# Altium schematic sheet MGT.SchDoc: FPGA MGTs
size B; Organization: UCLA High Energy Physics; DocumentNumber: 6; Revision: 2.0; SheetNumber: 6; SheetTotal: 12; CurrentDate: 8/7/2018; ModifiedDate: 8/20/2018
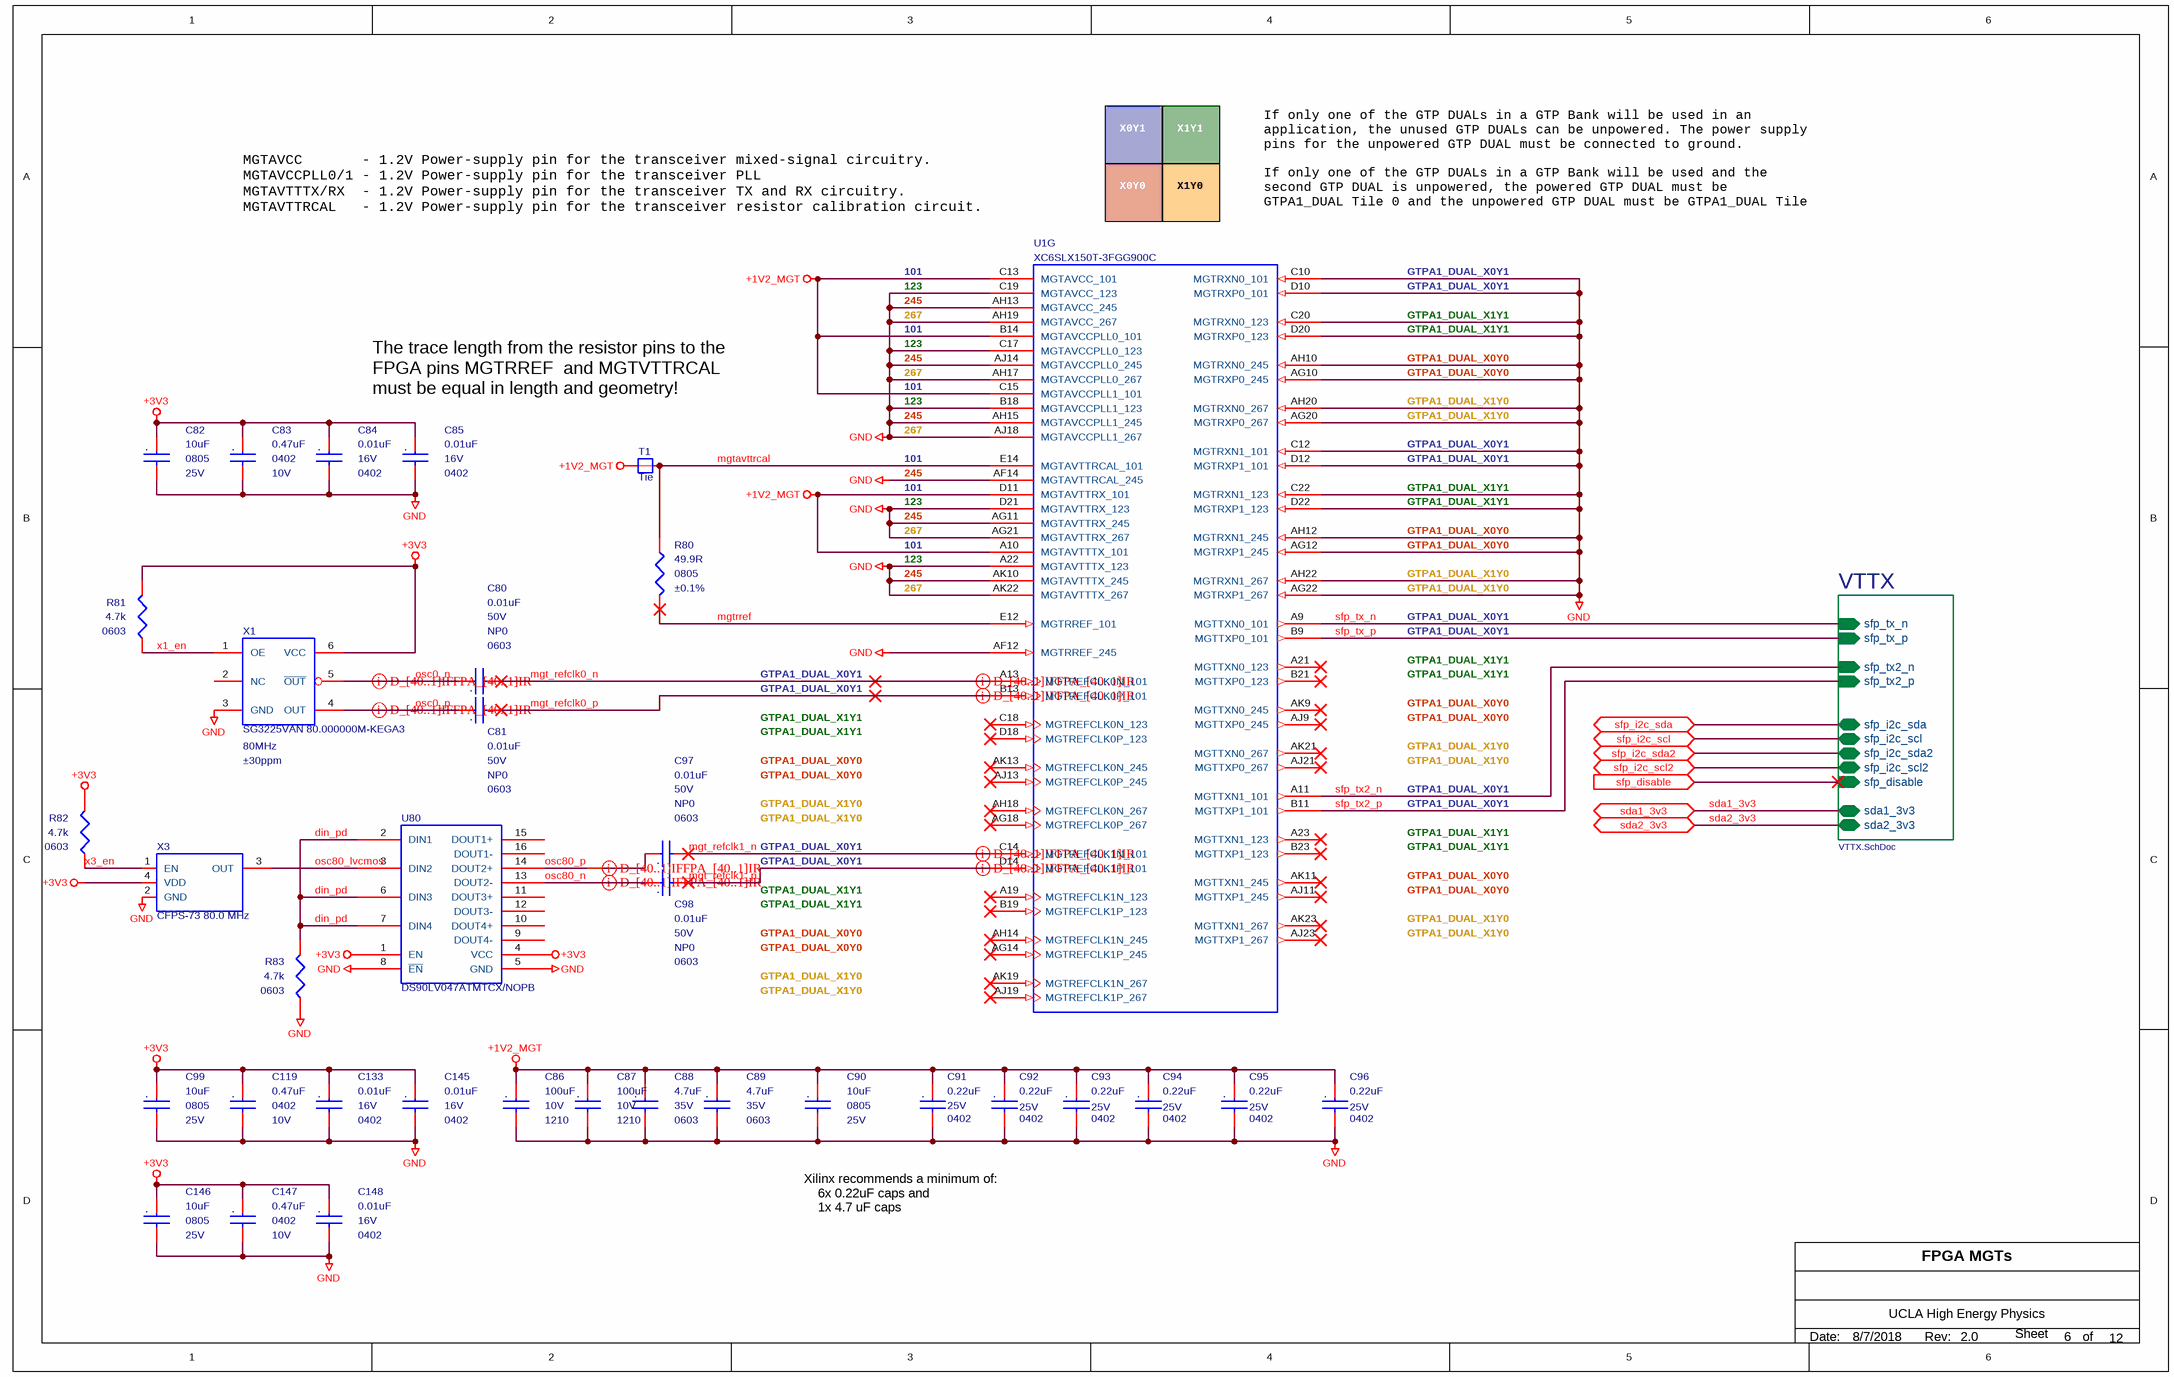
[diagram p0: MGT.SchDoc]

## Parts
C80  0.01uF  Temperature Coefficient: NP0  package: 0603  Voltage - Rated: 50V  [MC_S6/SM/C_0603_IPC]
C81  0.01uF  Temperature Coefficient: NP0  package: 0603  Voltage - Rated: 50V  [MC_S6/SM/C_0603_IPC]
C82  10uF  Voltage - Rated: 25V  package: 0805  [MC_S6/SM/C_0805_IPC]
C83  0.47uF  Voltage - Rated: 10V  package: 0402  [MC_S6/SM/C_0402_IPC]
C84  0.01uF  Voltage - Rated: 16V  package: 0402  [MC_S6/SM/C_0402_IPC]
C85  0.01uF  Voltage - Rated: 16V  package: 0402  [MC_S6/SM/C_0402_IPC]
C86  100uF  Voltage - Rated: 10V  package: 1210  [MC_S6/SM/C_1210_IPC]
C87  100uF  Voltage - Rated: 10V  package: 1210  [MC_S6/SM/C_1210_IPC]
C88  4.7uF  Voltage - Rated: 35V  package: 0603  [MC_S6/SM/C_0603_IPC]
C89  4.7uF  Voltage - Rated: 35V  package: 0603  [MC_S6/SM/C_0603_IPC]
C90  10uF  Voltage - Rated: 25V  package: 0805  [MC_S6/SM/C_0805_IPC]
C91  0.22uF  Voltage - Rated: 25V  package: 0402  [MC_S6/SM/C_0402_IPC]
C92  0.22uF  Voltage - Rated: 25V  package: 0402  [MC_S6/SM/C_0402_IPC]
C93  0.22uF  Voltage - Rated: 25V  package: 0402  [MC_S6/SM/C_0402_IPC]
C94  0.22uF  Voltage - Rated: 25V  package: 0402  [MC_S6/SM/C_0402_IPC]
C95  0.22uF  Voltage - Rated: 25V  package: 0402  [MC_S6/SM/C_0402_IPC]
C96  0.22uF  Voltage - Rated: 25V  package: 0402  [MC_S6/SM/C_0402_IPC]
C97  0.01uF  Temperature Coefficient: NP0  package: 0603  Voltage - Rated: 50V  [MC_S6/SM/C_0603_IPC]
C98  0.01uF  Temperature Coefficient: NP0  package: 0603  Voltage - Rated: 50V  [MC_S6/SM/C_0603_IPC]
C99  10uF  Voltage - Rated: 25V  package: 0805  [MC_S6/SM/C_0805_IPC]
C119  0.47uF  Voltage - Rated: 10V  package: 0402  [MC_S6/SM/C_0402_IPC]
C133  0.01uF  Voltage - Rated: 16V  package: 0402  [MC_S6/SM/C_0402_IPC]
C145  0.01uF  Voltage - Rated: 16V  package: 0402  [MC_S6/SM/C_0402_IPC]
C146  10uF  Voltage - Rated: 25V  package: 0805  [MC_S6/SM/C_0805_IPC]
C147  0.47uF  Voltage - Rated: 10V  package: 0402  [MC_S6/SM/C_0402_IPC]
C148  0.01uF  Voltage - Rated: 16V  package: 0402  [MC_S6/SM/C_0402_IPC]
R80  49.9R  Tolerance: ±0.1%  Supplier Device Package: 0805  [MC_S6/SM/R_0805_IPC]
R81  4.7k  Supplier Device Package: 0603  [MC_S6/SM/R_0603_IPC]
R82  4.7k  Supplier Device Package: 0603  [MC_S6/SM/R_0603_IPC]
R83  4.7k  Supplier Device Package: 0603  [MC_S6/SM/R_0603_IPC]
T1  Tie  [MC_S6/TH/TIE_VIA]  (net tie, no BOM)
U1  XC6SLX150T-3FGG900C  [MC_S6/BGA/FGG900]  (part G of 13)
U80  DS90LV047ATMTCX/NOPB  [MC_S6/SM/TSSOP16]
X1  SG3225VAN 80.000000M-KEGA3  Frequency: 80MHz  Frequency Stability: ±30ppm  [MC_S6/SM/XTAL-LVDS-3.2-2.5]
X3  CFPS-73 80.0 MHz  [MC_S6/SM/XTAL-7x5.08]

## Sub-sheets
VTTX = VTTX.SchDoc: sfp_tx2_n (in), sfp_tx2_p (in), sfp_i2c_sda2 (bidir), sfp_i2c_scl (bidir), sfp_i2c_sda (bidir), sfp_i2c_scl2 (bidir), sfp_tx_n (in), sfp_tx_p (in), sfp_disable (in), sda2_3v3 (bidir), sda1_3v3 (bidir)

## Ports
sda1_3v3 (bidir), sda2_3v3 (bidir), sfp_disable (in), sfp_i2c_scl2 (bidir), sfp_i2c_scl (bidir), sfp_i2c_sda2 (bidir), sfp_i2c_sda (bidir)

## Nets
+1V2_MGT: C86.1 C87.1 C88.1 C89.1 C90.1 C91.1 C92.1 C93.1 C94.1 C95.1 C96.1 T1.2 U1.A10(MGTAVTTTX_101) U1.B14(MGTAVCCPLL0_101) U1.C13(MGTAVCC_101) U1.C15(MGTAVCCPLL1_101) U1.D11(MGTAVTTRX_101)
+3V3: C82.1 C83.1 C84.1 C85.1 C99.1 C119.1 C133.1 C145.1 C146.1 C147.1 C148.1 R81.1 R82.1 U80.1(EN) U80.4(VCC) X1.6(VCC) X3.4(VDD)
GND: C82.2 C83.2 C84.2 C85.2 C86.2 C87.2 C88.2 C89.2 C90.2 C91.2 C92.2 C93.2 C94.2 C95.2 C96.2 C99.2 C119.2 C133.2 C145.2 C146.2 C147.2 C148.2 R83.2 U1.A22(MGTAVTTTX_123) U1.AF12(MGTRREF_245) U1.AF14(MGTAVTTRCAL_245) U1.AG10(MGTRXP0_245) U1.AG11(MGTAVTTRX_245) U1.AG12(MGTRXP1_245) U1.AG20(MGTRXP0_267) U1.AG21(MGTAVTTRX_267) U1.AG22(MGTRXP1_267) U1.AH10(MGTRXN0_245) U1.AH12(MGTRXN1_245) U1.AH13(MGTAVCC_245) U1.AH15(MGTAVCCPLL1_245) U1.AH17(MGTAVCCPLL0_267) U1.AH19(MGTAVCC_267) U1.AH20(MGTRXN0_267) U1.AH22(MGTRXN1_267) U1.AJ14(MGTAVCCPLL0_245) U1.AJ18(MGTAVCCPLL1_267) U1.AK10(MGTAVTTTX_245) U1.AK22(MGTAVTTTX_267) U1.B18(MGTAVCCPLL1_123) U1.C10(MGTRXN0_101) U1.C12(MGTRXN1_101) U1.C17(MGTAVCCPLL0_123) U1.C19(MGTAVCC_123) U1.C20(MGTRXN0_123) U1.C22(MGTRXN1_123) U1.D10(MGTRXP0_101) U1.D12(MGTRXP1_101) U1.D20(MGTRXP0_123) U1.D21(MGTAVTTRX_123) U1.D22(MGTRXP1_123) U80.5(GND) U80.8(~{EN}) X1.3(GND) X3.2(GND)
din_pd: R83.1 U80.2(DIN1) U80.6(DIN3) U80.7(DIN4)
mgt_refclk0_n: C80.2 U1.A13(MGTREFCLK0N_101)
mgt_refclk0_p: C81.2 U1.B13(MGTREFCLK0P_101)
mgt_refclk1_n: C97.2 U1.C14(MGTREFCLK1N_101)
mgt_refclk1_p: C98.2 U1.D14(MGTREFCLK1P_101)
mgtavttrcal: R80.1 T1.1 U1.E14(MGTAVTTRCAL_101)
mgtrref: R80.2 U1.E12(MGTRREF_101)
osc0_n: C80.1 X1.5(~{OUT})
osc0_p: C81.1 X1.4(OUT)
osc80_lvcmos: U80.3(DIN2) X3.3(OUT)
osc80_n: C98.1 U80.13(DOUT2-)
osc80_p: C97.1 U80.14(DOUT2+)
sda1_3v3: port sda1_3v3, sheet VTTX/sda1_3v3
sda2_3v3: port sda2_3v3, sheet VTTX/sda2_3v3
sfp_disable: port sfp_disable, sheet VTTX/sfp_disable
sfp_i2c_scl: port sfp_i2c_scl, sheet VTTX/sfp_i2c_scl
sfp_i2c_scl2: port sfp_i2c_scl2, sheet VTTX/sfp_i2c_scl2
sfp_i2c_sda: port sfp_i2c_sda, sheet VTTX/sfp_i2c_sda
sfp_i2c_sda2: port sfp_i2c_sda2, sheet VTTX/sfp_i2c_sda2
sfp_tx2_n: U1.A11(MGTTXN1_101) ; sheet VTTX/sfp_tx2_n
sfp_tx2_p: U1.B11(MGTTXP1_101) ; sheet VTTX/sfp_tx2_p
sfp_tx_n: U1.A9(MGTTXN0_101) ; sheet VTTX/sfp_tx_n
sfp_tx_p: U1.B9(MGTTXP0_101) ; sheet VTTX/sfp_tx_p
x1_en: R81.2 X1.1(OE)
x3_en: R82.2 X3.1(EN)

Not connected (* = marked no-connect by the designer): U1 A19(MGTREFCLK1N_123)* A21(MGTTXN0_123)* A23(MGTTXN1_123)* AG14(MGTREFCLK1P_245)* AG18(MGTREFCLK0P_267)* AH14(MGTREFCLK1N_245)* AH18(MGTREFCLK0N_267)* AJ9(MGTTXP0_245)* AJ11(MGTTXP1_245)* AJ13(MGTREFCLK0P_245)* AJ19(MGTREFCLK1P_267)* AJ21(MGTTXP0_267)* AJ23(MGTTXP1_267)* AK9(MGTTXN0_245)* AK11(MGTTXN1_245)* AK13(MGTREFCLK0N_245)* AK19(MGTREFCLK1N_267)* AK21(MGTTXN0_267)* AK23(MGTTXN1_267)* B19(MGTREFCLK1P_123)* B21(MGTTXP0_123)* B23(MGTTXP1_123)* C18(MGTREFCLK0N_123)* D18(MGTREFCLK0P_123)*; U80 9(DOUT4-) 10(DOUT4+) 11(DOUT3+) 12(DOUT3-) 15(DOUT1+) 16(DOUT1-); X1 2(NC)

## Layout directives
differential pair: mgt_refclk0_n, mgt_refclk0_p, mgt_refclk1_n, mgt_refclk1_p, osc0_n, osc0_p, osc80_n, osc80_p

## Notes on the sheet
- X0Y1
- X1Y1
- (near U1) MGTAVCC       - 1.2V Power-supply pin for the transceiver mixed-signal circuitry.
  MGTAVCCPLL0/1 - 1.2V Power-supply pin for the transceiver PLL
  MGTAVTTTX/RX  - 1.2V Power-supply pin for the transceiver TX and RX circuitry.
  MGTAVTTRCAL   - 1.2V Power-supply pin for the transceiver resistor calibration circuit.
- X0Y0
- X1Y0
- If only one of the GTP DUALs in a GTP Bank will be used in an application, the unused GTP DUALs can be unpowered. The power supply pins for the unpowered GTP DUAL must be connected to ground.
  If only one of the GTP DUALs in a GTP Bank will be used and the second GTP DUAL is unpowered, the powered GTP DUAL must be GTPA1_DUAL Tile 0 and the unpowered GTP DUAL must be GTPA1_DUAL Tile 1.
- 101
- 123
- 245
- 267
- GTPA1_DUAL_X0Y1
- GTPA1_DUAL_X1Y1
- GTPA1_DUAL_X0Y0
- (near C85) The trace length from the resistor pins to the FPGA pins MGTRREF  and MGTVTTRCAL must be equal in length and geometry!
- GTPA1_DUAL_X1Y0
- Xilinx recommends a minimum of:
  6x 0.22uF caps and
  1x 4.7 uF caps
- Date:
- Rev:
- of
- Sheet
- (in symbol C0402C103K4RACTU) .
- (in symbol C0603C103J3GACTU) .
- (in symbol GRM21BR61E106KA73L) .
- (in symbol GRM155R61A474KE15J) .
- (in symbol GRM155R71C224KA12D) .
- (in symbol GRM188R6YA475KE15D) .
- (in symbol LMK325BJ107MM-T) .

## Library data of the parts
C80 C81 C97 C98 = C0603C103J3GACTU: CAP CER 10000PF 50V NP0 0603; Manufacturer: KEMET; Tolerance: ±5%; Supplier 1: Digi-Key; Manufacturer Part Number: C0603C103J3GACTU; RoHS: RoHS Compliant; Category: Capacitors; Stock 1: 190820; Pricing 1: 1=0.33, 10=0.231, 100=0.1385, 500=0.10388, 1000=0.08772 (USD); Packaging: Cut Tape (CT); Part Status: Active; Capacitance: 10000pF; Operating Temperature: -55°C ~ 125°C; Features: Low ESL; Ratings: -; Applications: General Purpose; Mounting Type: Surface Mount, MLCC; Package / Case: 0603 (1608 Metric); Size / Dimension: 0.063" L x 0.031" W (1.60mm x 0.80mm); Height - Seated (Max): -; Thickness (Max): 0.034" (0.87mm); Lead Spacing: -; Lead Style: -; ComponentLink1URL: http://www.kemet.com/docfinder?Partnumber=C0603C103J3GACTU; ComponentLink1Description: http://www.kemet.com/docfinder?Partnumber=C0603C103J3GACTU; Supplier 2: Digi-Key; Stock 2: 190820; Pricing 2: 1=0.33, 10=0.231, 100=0.1385, 500=0.10388, 1000=0.08772 (USD); Supplier Part Number 1: 399-7838-1-ND; Supplier Part Number 2: 399-7838-6-ND; Failure Rate: -
C82 C90 C99 C146 = GRM21BR61E106KA73L: CAP CER 10UF 25V X5R 0805; Manufacturer: Murata Electronics North America; Capacitance: 10µF; Tolerance: ±10%; Supplier 1: Digi-Key; Manufacturer Part Number: GRM21BR61E106KA73L; RoHS: RoHS Compliant; Category: Capacitors; Stock 1: 607428; Pricing 1: 1=0.19, 10=0.13, 50=0.0748, 100=0.0618, 250=0.052, 500=0.04356, 1000=0.03575 (USD); Packaging: Cut Tape (CT); Part Status: Active; Temperature Coefficient: X5R; Operating Temperature: -55°C ~ 85°C; Features: -; Ratings: -; Applications: General Purpose; Mounting Type: Surface Mount, MLCC; Package / Case: 0805 (2012 Metric); Size / Dimension: 0.079" L x 0.049" W (2.00mm x 1.25mm); Height - Seated (Max): -; Thickness (Max): 0.053" (1.35mm); Lead Spacing: -; Lead Style: -; ComponentLink1URL: http://www.murata.com/~/media/webrenewal/support/library/catalog/products/capacitor/mlcc/c02e.pdf; ComponentLink1Description: http://www.murata.com/~/media/webrenewal/support/library/catalog/products/capacitor/mlcc/c02e.pdf; Supplier 2: Digi-Key; Supplier Part Number 1: 490-5523-1-ND; Supplier Part Number 2: 490-5523-6-ND
C83 C119 C147 = GRM155R61A474KE15J: CAP CER 0.47UF 10V X5R 0402; Manufacturer: Murata Electronics North America; Capacitance: 0.47µF; Tolerance: ±10%; Supplier 1: Digi-Key; Manufacturer Part Number: GRM155R61A474KE15J; RoHS: RoHS Compliant; Category: Capacitors; Stock 1: 35266; Pricing 1: 1=0.1, 10=0.074, 100=0.0329, 500=0.02348, 1000=0.01845, 2500=0.01678, 5000=0.01543 (USD); Packaging: Cut Tape (CT); Part Status: Active; Operating Temperature: -55°C ~ 85°C; Features: -; Ratings: -; Applications: General Purpose; Mounting Type: Surface Mount, MLCC; Package / Case: 0402 (1005 Metric); Size / Dimension: 0.039" L x 0.020" W (1.00mm x 0.50mm); Height - Seated (Max): -; Thickness (Max): 0.022" (0.55mm); Lead Spacing: -; ComponentLink1URL: http://www.murata.com/~/media/webrenewal/support/library/catalog/products/capacitor/mlcc/c02e.ashx; ComponentLink1Description: http://www.murata.com/~/media/webrenewal/support/library/catalog/products/capacitor/mlcc/c02e.ashx; Supplier 2: Digi-Key; Stock 2: 35286; Pricing 2: 1=0.1, 10=0.074, 100=0.0329, 500=0.02348, 1000=0.01845, 2500=0.01678, 5000=0.01543 (USD); Supplier Part Number 1: 490-6305-1-ND; Supplier Part Number 2: 490-6305-6-ND; Temperature Coefficient: X5R
C84 C85 C133 C145 C148 = C0402C103K4RACTU: CAP CER 10nF 16V X7R 0402; Manufacturer: KEMET; Capacitance: 10000pF; Tolerance: ±10%; Supplier 1: Digi-Key; Manufacturer Part Number: C0402C103K4RACTU; RoHS: RoHS Compliant; Category: Capacitors; Stock 1: 605739; Pricing 1: 1=0.1, 10=0.02, 25=0.0144, 50=0.0108, 100=0.0088, 250=0.00732, 500=0.00626, 1000=0.00492, 5000=0.00412 (USD); Packaging: Cut Tape (CT); Part Status: Active; Temperature Coefficient: X7R; Operating Temperature: -55°C ~ 125°C; Features: -; Ratings: -; Applications: General Purpose; Failure Rate: -; Mounting Type: Surface Mount, MLCC; Package / Case: 0402 (1005 Metric); Size / Dimension: 0.039" L x 0.020" W (1.00mm x 0.50mm); Height - Seated (Max): -; Thickness (Max): 0.022" (0.55mm); Lead Spacing: -; Lead Style: -; ComponentLink1URL: http://www.kemet.com/docfinder?Partnumber=C0402C103K4RACTU; ComponentLink1Description: http://www.kemet.com/docfinder?Partnumber=C0402C103K4RACTU; Supplier 2: Digi-Key; Stock 2: 605739; Pricing 2: 1=0.1, 10=0.02, 25=0.0144, 50=0.0108, 100=0.0088, 250=0.00732, 500=0.00626, 1000=0.00492, 5000=0.00412 (USD); Supplier Part Number 1: 399-1038-1-ND; Supplier Part Number 2: 399-1038-6-ND
C86 C87 = LMK325BJ107MM-T: CAP CER 100UF 10V X5R 1210; Manufacturer: Taiyo Yuden; Capacitance: 100µF; Tolerance: ±20%; Supplier 1: Digi-Key; Manufacturer Part Number: LMK325BJ107MM-T; RoHS: RoHS Compliant; Category: Capacitors; Stock 1: 345948; Pricing 1: 1=1.15, 10=0.909, 25=0.8332, 50=0.7878, 100=0.6818, 250=0.60608 (USD); Packaging: Cut Tape (CT); Part Status: Active; Temperature Coefficient: X5R; Operating Temperature: -55°C ~ 85°C; Features: -; Ratings: -; Applications: General Purpose; Mounting Type: Surface Mount, MLCC; Package / Case: 1210 (3225 Metric); Size / Dimension: 0.126" L x 0.098" W (3.20mm x 2.50mm); Height - Seated (Max): -; Thickness (Max): 0.106" (2.70mm); Lead Spacing: -; Lead Style: -; ComponentLink1URL: http://www.yuden.co.jp/productdata/catalog/en/mlcc_all_e.pdf; ComponentLink1Description: http://www.yuden.co.jp/productdata/catalog/en/mlcc_all_e.pdf; Supplier 2: Digi-Key; Stock 2: 345948; Pricing 2: 1=1.16, 10=0.914, 25=0.8376, 50=0.792, 100=0.6855, 250=0.60932 (USD); Supplier Part Number 1: 587-1965-1-ND; Supplier Part Number 2: 587-1965-6-ND
C88 C89 = GRM188R6YA475KE15D: CAP CER 4.7UF 35V X5R 0603; Manufacturer: Murata; Capacitance: 4.7µF; Tolerance: ±10%; Product Training Modules: High-Cap Multilayer Ceramic Capacitors; Featured Product: GA3 Safety Recognized Capacitors; EDA / CAD Models: Download from Accelerated Designs; Online Catalog: GRM Series; Other Names: 490-7205-2; Supplier 1: Digikey; Manufacturer Part Number: GRM188R6YA475KE15D; Category: Capacitors; Stock 1: 180441; Pricing 1: 1=0.32, 10=0.264, 50=0.1486, 100=0.132, 250=0.099, 500=0.0875, 1000=0.0776 (USD); Packaging: Tape & Reel (TR); Temperature Coefficient: X5R; Operating Temperature: -55°C ~ 85°C; Applications: General Purpose; Mounting Type: Surface Mount, MLCC; Package / Case: 0603 (1608 Metric); Size / Dimension: 0.063" L x 0.031" W (1.60mm x 0.80mm); Thickness (Max): 0.031" (0.80mm); ComponentLink1URL: https://datasheet.ciiva.com/46444/1769893-46444984.pdf; ComponentLink1Description: https://datasheet.ciiva.com/46444/1769893-46444984.pdf; Supplier 2: Digikey; Stock 2: 180441; Pricing 2: 1=0.32, 10=0.264, 50=0.1486, 100=0.132, 250=0.099, 500=0.0875, 1000=0.0776 (USD); Supplier Part Number 1: 490-7205-1-ND; Supplier Part Number 2: 490-7205-6-ND; Standard Package: 4,000; Family: Ceramic Capacitors; Series: GRM; ComponentLink2URL: https://datasheet.ciiva.com/46444/1769893-46444985.pdf; ComponentLink2Description: https://datasheet.ciiva.com/46444/1769893-46444985.pdf; ComponentLink3URL: https://datasheet.ciiva.com/14906/partnumbering-e-01-14906426.pdf; ComponentLink3Description: https://datasheet.ciiva.com/14906/partnumbering-e-01-14906426.pdf; ComponentLink4URL: https://datasheet.ciiva.com/14906/partnumbering-e-01-14906427.pdf; ComponentLink4Description: https://datasheet.ciiva.com/14906/partnumbering-e-01-14906427.pdf; ComponentLink5URL: https://datasheet.ciiva.com/14906/partnumbering-e-01-14906428.pdf; ComponentLink5Description: https://datasheet.ciiva.com/14906/partnumbering-e-01-14906428.pdf
C91-C96 = GRM155R71C224KA12D: CAP CER 0.22UF 15V X7R 0402; Manufacturer: Murata Electronics North America; Capacitance: 0.22µF; Tolerance: ±10%; Supplier 1: Digi-Key; Manufacturer Part Number: GRM155R71C224KA12D; RoHS: RoHS Compliant; Category: Capacitors; Stock 1: 1853641; Pricing 1: 1=0.1, 10=0.063, 100=0.0279, 500=0.0199, 1000=0.01564, 2500=0.01422, 5000=0.01308 (USD); Packaging: Cut Tape (CT); Part Status: Active; Operating Temperature: -55°C ~ 125°C; Features: -; Ratings: -; Applications: General Purpose; Mounting Type: Surface Mount, MLCC; Package / Case: 0402 (1005 Metric); Size / Dimension: 0.039" L x 0.020" W (1.00mm x 0.50mm); Height - Seated (Max): -; Thickness (Max): 0.022" (0.55mm); Lead Spacing: -; Lead Style: -; ComponentLink1URL: http://www.murata.com/~/media/webrenewal/support/library/catalog/products/capacitor/mlcc/c02e.ashx; ComponentLink1Description: http://www.murata.com/~/media/webrenewal/support/library/catalog/products/capacitor/mlcc/c02e.ashx; Supplier 2: Digi-Key; Stock 2: 1854141; Pricing 2: 1=0.1, 10=0.063, 100=0.0279, 500=0.0199, 1000=0.01564, 2500=0.01422, 5000=0.01308 (USD); Supplier Part Number 1: 490-5418-1-ND; Supplier Part Number 2: 490-5418-6-ND; Temperature Coefficient: X7R
R80 = ERA-6AEB49R9V: RES SMD 49.9 OHM 0.1% 1/8W 0805; Manufacturer: Panasonic Electronic Components; Resistance (Ohms): 49.9; Power (Watts): 0.125W, 1/8W; Temperature Coefficient: ±25ppm/°C; Supplier 1: Digi-Key; Manufacturer Part Number: ERA-6AEB49R9V; RoHS: RoHS Compliant; Category: Resistors; Stock 1: 51151; Pricing 1: 1=0.53, 50=0.21, 100=0.162, 250=0.126, 500=0.0888, 1000=0.0648 (USD); Packaging: Cut Tape (CT); Part Status: Active; Composition: Thin Film; Features: Automotive AEC-Q200; Operating Temperature: -55°C ~ 155°C; Package / Case: 0805 (2012 Metric); Size / Dimension: 0.079" L x 0.049" W (2.00mm x 1.25mm); Height - Seated (Max): 0.024" (0.60mm); Number of Terminations: 2; Failure Rate: -; ComponentLink1URL: https://industrial.panasonic.com/cdbs/www-data/pdf/RDA0000/AOA0000C237.pdf; ComponentLink1Description: https://industrial.panasonic.com/cdbs/www-data/pdf/RDA0000/AOA0000C237.pdf; Supplier 2: Digi-Key; Stock 2: 51151; Pricing 2: 1=0.53, 50=0.21, 100=0.162, 250=0.126, 500=0.0888, 1000=0.0648 (USD); Supplier Part Number 1: P49.9DACT-ND; Supplier Part Number 2: P49.9DADKR-ND
R81-R83 = CR0603-FX-4701ELF: RES SMD 4.7K OHM 1% 1/10W 0603; Manufacturer: Bourns Inc.; Power (Watts): 0.1W, 1/10W; Temperature Coefficient: ±100ppm/°C; Supplier 1: Digi-Key; Manufacturer Part Number: CR0603-FX-4701ELF; RoHS: RoHS Compliant; Category: Resistors; Stock 1: 43560; Pricing 1: 1=0.1, 10=0.021, 100=0.0086, 1000=0.00385, 2500=0.00334 (USD); Packaging: Cut Tape (CT); Part Status: Active; Resistance (Ohms): 4.7k; Composition: Thick Film; Features: Moisture Resistant; Operating Temperature: -55°C ~ 155°C; Package / Case: 0603 (1608 Metric); Size / Dimension: 0.063" L x 0.031" W (1.60mm x 0.80mm); Height - Seated (Max): 0.022" (0.55mm); Failure Rate: -; ComponentLink1URL: http://www.bourns.com/docs/Product-Datasheets/CHPREZTR.pdf; ComponentLink1Description: http://www.bourns.com/docs/Product-Datasheets/CHPREZTR.pdf; Supplier 2: Digi-Key; Stock 2: 43560; Pricing 2: 1=0.1, 10=0.021, 100=0.0086, 1000=0.00385, 2500=0.00334 (USD); Supplier Part Number 1: CR0603-FX-4701ELFCT-ND; Supplier Part Number 2: CR0603-FX-4701ELFDKR-ND; Tolerance: ±1%
T1 = NET TIE VIA
U1 = XC6SLX150T-3FGG900C: Spartan-6 LXT 1.2V FPGA, 540 User I/Os, 900-Ball Chip-Scale BGA (1.0mm Pitch), Speed Grade 3, Commercial Grade, Pb-Free; Manufacturer: Xilinx Inc.; Number of I/O: 540; Voltage - Supply: 1.14 V ~ 1.26 V; DatasheetVersion: ver1.6, Nov-2010; PackageVersion: ver1.4, Nov-2009; PackageReference: FGG900; PackageDescription: 900-Ball Fine-Pitch Ball Grid Array (FGG900) - Pb-Free; Code_JEDEC: MS-034-AAN-1; Code_IPC: BGA100P30X30-900; ComponentLink1Description: Manufacturer URL; ComponentLink1URL: http://www.xilinx.com/; ComponentLink2Description: Spartan-6 Datasheet; ComponentLink2URL: http://www.xilinx.com/support/documentation/data_sheets/ds160.pdf; ComponentLink3Description: Spartan-6 Documents; ComponentLink3URL: http://www.xilinx.com/support/documentation/spartan-6.htm; Supplier 1: Digi-Key; Manufacturer Part Number: XC6SLX150T-3FGG900C; RoHS: RoHS Compliant; Category: Integrated Circuits (ICs); Stock 1: 0; Pricing 1: 27=287.3 (USD); Part Status: Active; Mounting Type: Surface Mount; Operating Temperature: 0°C ~ 85°C (TJ); Package / Case: 900-BBGA; Supplier Device Package: 900-FBGA (31x31); ComponentLink4URL: http://www.xilinx.com/support/documentation/data_sheets/ds162.pdf; ComponentLink4Description: http://www.xilinx.com/support/documentation/data_sheets/ds162.pdf; Supplier Part Number 1: XC6SLX150T-3FGG900C-ND
U80 = DS90LV047ATMTCX: IC LINE DVR 3V QUAD DIFF 16TSSOP; Manufacturer: TI National Semiconductor; Data Rate: 400Mbps; Number of Channels: 4; Power Consumption: 14W; Operating Supply Voltage: 3.3V; Propagation Delay: 1.7ns; Max Power Dissipation: 866mW; Max Supply Voltage: 3.6V; Operating Supply Current: 30mA; Max Supply Current: 20mA; Supplier 1: Digi-Key; Manufacturer Part Number: DS90LV047ATMTCX/NOPB; Stock 1: 29207; Pricing 1: 1=2.91, 10=2.618, 100=2.104, 500=1.7286, 1000=1.43227 (USD); Mount: Surface Mount; Case/Package: TSSOP; Number of Pins: 16; Weight: 0.002222oz; Min Operating Temperature: -40°C; Max Operating Temperature: 85°C; Packaging: Tape and Reel; Number of Receivers: 4; Number of Elements: 4; Min Supply Voltage: 3V; Number of Drivers: 4; Turn-On Delay Time: 1.7ns; Power Dissipation: 866mW; Radiation Hardening: No; Lead Free: Lead Free; REACH SVHC: No SVHC; ComponentLink1URL: https://datasheet.ciiva.com/12096/snls044b-72207-12096627.pdf; ComponentLink1Description: https://datasheet.ciiva.com/12096/snls044b-72207-12096627.pdf; ComponentLink2URL: https://datasheet.ciiva.com/3151/ds90lv047a-3151495.pdf; ComponentLink2Description: https://datasheet.ciiva.com/3151/ds90lv047a-3151495.pdf; ComponentLink3URL: https://datasheet.ciiva.com/6635/ds90lv047a-6635303.pdf; ComponentLink3Description: https://datasheet.ciiva.com/6635/ds90lv047a-6635303.pdf; ComponentLink4URL: https://datasheet.ciiva.com/6635/ds90lv047a-6635304.pdf; ComponentLink4Description: https://datasheet.ciiva.com/6635/ds90lv047a-6635304.pdf; ComponentLink5URL: https://datasheet.ciiva.com/6635/ds90lv047a-6635305.pdf; ComponentLink5Description: https://datasheet.ciiva.com/6635/ds90lv047a-6635305.pdf; ComponentLink6URL: https://datasheet.ciiva.com/15133/getdatasheetpartid-55660-15133789.pdf; ComponentLink6Description: https://datasheet.ciiva.com/15133/getdatasheetpartid-55660-15133789.pdf; Supplier Part Number 1: DS90LV047ATMTCX/NOPBDKR-ND
X1 = SG3225VAN 80.000000M-KEGA3: OSC 80.0000MHZ LVDS SMD; Manufacturer: EPSON; Function: Enable/Disable; Voltage - Supply: 2.5 V ~ 3.3 V; Current - Supply (Max): 30mA; Current - Supply (Disable) (Max): 20mA; Supplier 1: Digi-Key; Manufacturer Part Number: SG3225VAN 80.000000M-KEGA3; RoHS: RoHS Compliant; Category: Crystals, Oscillators, Resonators; Stock 1: 107; Pricing 1: 1=2.29, 10=2.241, 50=2.134, 100=1.8673 (USD); Packaging: Cut Tape (CT); Part Status: Active; Type: XO (Standard); Output: LVDS; Operating Temperature: -40°C ~ 85°C; Ratings: -; Mounting Type: Surface Mount; Package / Case: 6-SMD, No Lead (DFN, LCC); Size / Dimension: 0.126" L x 0.098" W (3.20mm x 2.50mm); Height - Seated (Max): 0.047" (1.20mm); ComponentLink1URL: https://support.epson.biz/td/api/doc_check.php?dl=brief_SG3225EAN_en.pdf; ComponentLink1Description: https://support.epson.biz/td/api/doc_check.php?dl=brief_SG3225EAN_en.pdf; Supplier 2: Digi-Key; Stock 2: 107; Pricing 2: 1=2.29, 10=2.241, 50=2.134, 100=1.8673 (USD); Supplier Part Number 1: SER3935CT-ND; Supplier Part Number 2: SER3935DKR-ND
X3 = LFSPXO009441: XTAL, 80MHz, CMOS; Manufacturer: IQD; Manufacturer Part Number: LFSPXO009441REEL; Load Capacitance: 30pF; Frequency Stability: 50ppm; Supplier 1: Digi-Key; Stock 1: 827; Pricing 1: 1=2.72, 10=2.657, 50=2.53, 100=2.2138, 500=2.1505 (USD); Case/Package: CSMD; Number of Pins: 4; Min Operating Temperature: 0°C; Max Operating Temperature: 70°C; Frequency: 80MHz; Packaging: Tape and Reel; Length: 7.2mm; Depth: 5.2mm; ComponentLink1URL: http://components.arrow.com/part/dataview/0323_02291251; ComponentLink1Description: http://components.arrow.com/part/dataview/0323_02291251; Supplier Part Number 1: 1923-1130-6-ND